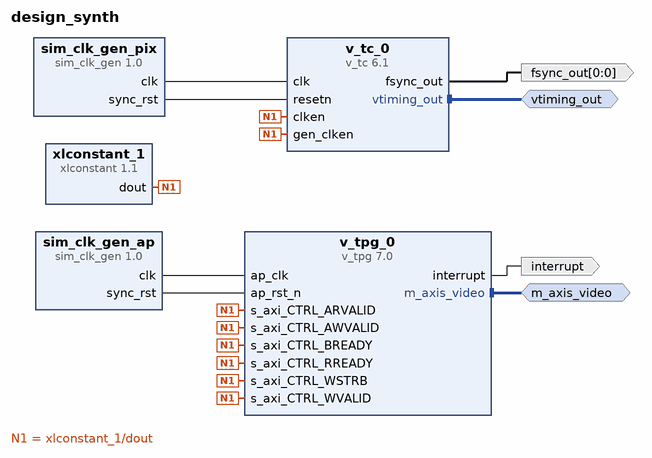
[diagram p0: block diagram of the top level]
# Vivado block design design_synth, xc7a50tcsg324-1, Vivado 2017.2
create_bd_design design_synth

create_bd_intf_port -mode Master -vlnv xilinx.com:interface:video_timing_rtl:2.0 vtiming_out
create_bd_intf_port -mode Master -vlnv xilinx.com:interface:axis_rtl:1.0 m_axis_video
create_bd_port -dir O -from 0 -to 0 fsync_out
create_bd_port -dir O -type intr interrupt

create_bd_cell -type ip -vlnv xilinx.com:ip:sim_clk_gen:1.0 sim_clk_gen_pix
set_property -dict {CONFIG.FREQ_HZ 40000000} [get_bd_cells sim_clk_gen_pix]
create_bd_cell -type ip -vlnv xilinx.com:ip:v_tc:6.1 v_tc_0
set_property -dict [list \
  CONFIG.HAS_AXI4_LITE false \
  CONFIG.VIDEO_MODE 800x600p \
  CONFIG.enable_detection false \
  CONFIG.vertical_blank_generation true \
  CONFIG.active_video_generation true \
  CONFIG.horizontal_blank_generation true \
] [get_bd_cells v_tc_0]
create_bd_cell -type ip -vlnv xilinx.com:ip:xlconstant:1.1 xlconstant_1
set_property -dict {CONFIG.CONST_VAL 1} [get_bd_cells xlconstant_1]
create_bd_cell -type ip -vlnv xilinx.com:ip:sim_clk_gen:1.0 sim_clk_gen_ap
create_bd_cell -type ip -vlnv xilinx.com:ip:v_tpg:7.0 v_tpg_0
set_property -dict [list \
  CONFIG.SOLID_COLOR 0 \
  CONFIG.RAMP 0 \
  CONFIG.DISPLAY_PORT 0 \
  CONFIG.COLOR_SWEEP 0 \
  CONFIG.ZONE_PLATE 0 \
  CONFIG.FOREGROUND 0 \
] [get_bd_cells v_tpg_0]

# ---- connections ----

connect_bd_intf_net [get_bd_intf_ports vtiming_out] [get_bd_intf_pins v_tc_0/vtiming_out]
connect_bd_intf_net [get_bd_intf_ports m_axis_video] [get_bd_intf_pins v_tpg_0/m_axis_video]
connect_bd_net [get_bd_pins sim_clk_gen_pix/clk] [get_bd_pins v_tc_0/clk]
connect_bd_net [get_bd_pins xlconstant_1/dout] \
  [get_bd_pins v_tc_0/clken] [get_bd_pins v_tc_0/gen_clken] [get_bd_pins v_tpg_0/s_axi_CTRL_ARVALID] \
  [get_bd_pins v_tpg_0/s_axi_CTRL_BREADY] [get_bd_pins v_tpg_0/s_axi_CTRL_RREADY] [get_bd_pins v_tpg_0/s_axi_CTRL_WVALID] \
  [get_bd_pins v_tpg_0/s_axi_CTRL_AWVALID] [get_bd_pins v_tpg_0/s_axi_CTRL_WSTRB]
connect_bd_net [get_bd_pins sim_clk_gen_pix/sync_rst] [get_bd_pins v_tc_0/resetn]
connect_bd_net [get_bd_pins sim_clk_gen_ap/clk] [get_bd_pins v_tpg_0/ap_clk]
connect_bd_net [get_bd_pins v_tc_0/fsync_out] [get_bd_ports fsync_out]
connect_bd_net [get_bd_pins sim_clk_gen_ap/sync_rst] [get_bd_pins v_tpg_0/ap_rst_n]
connect_bd_net [get_bd_pins v_tpg_0/interrupt] [get_bd_ports interrupt]

validate_bd_design
save_bd_design
